# Altium schematic sheet Main.SchDoc
size A3
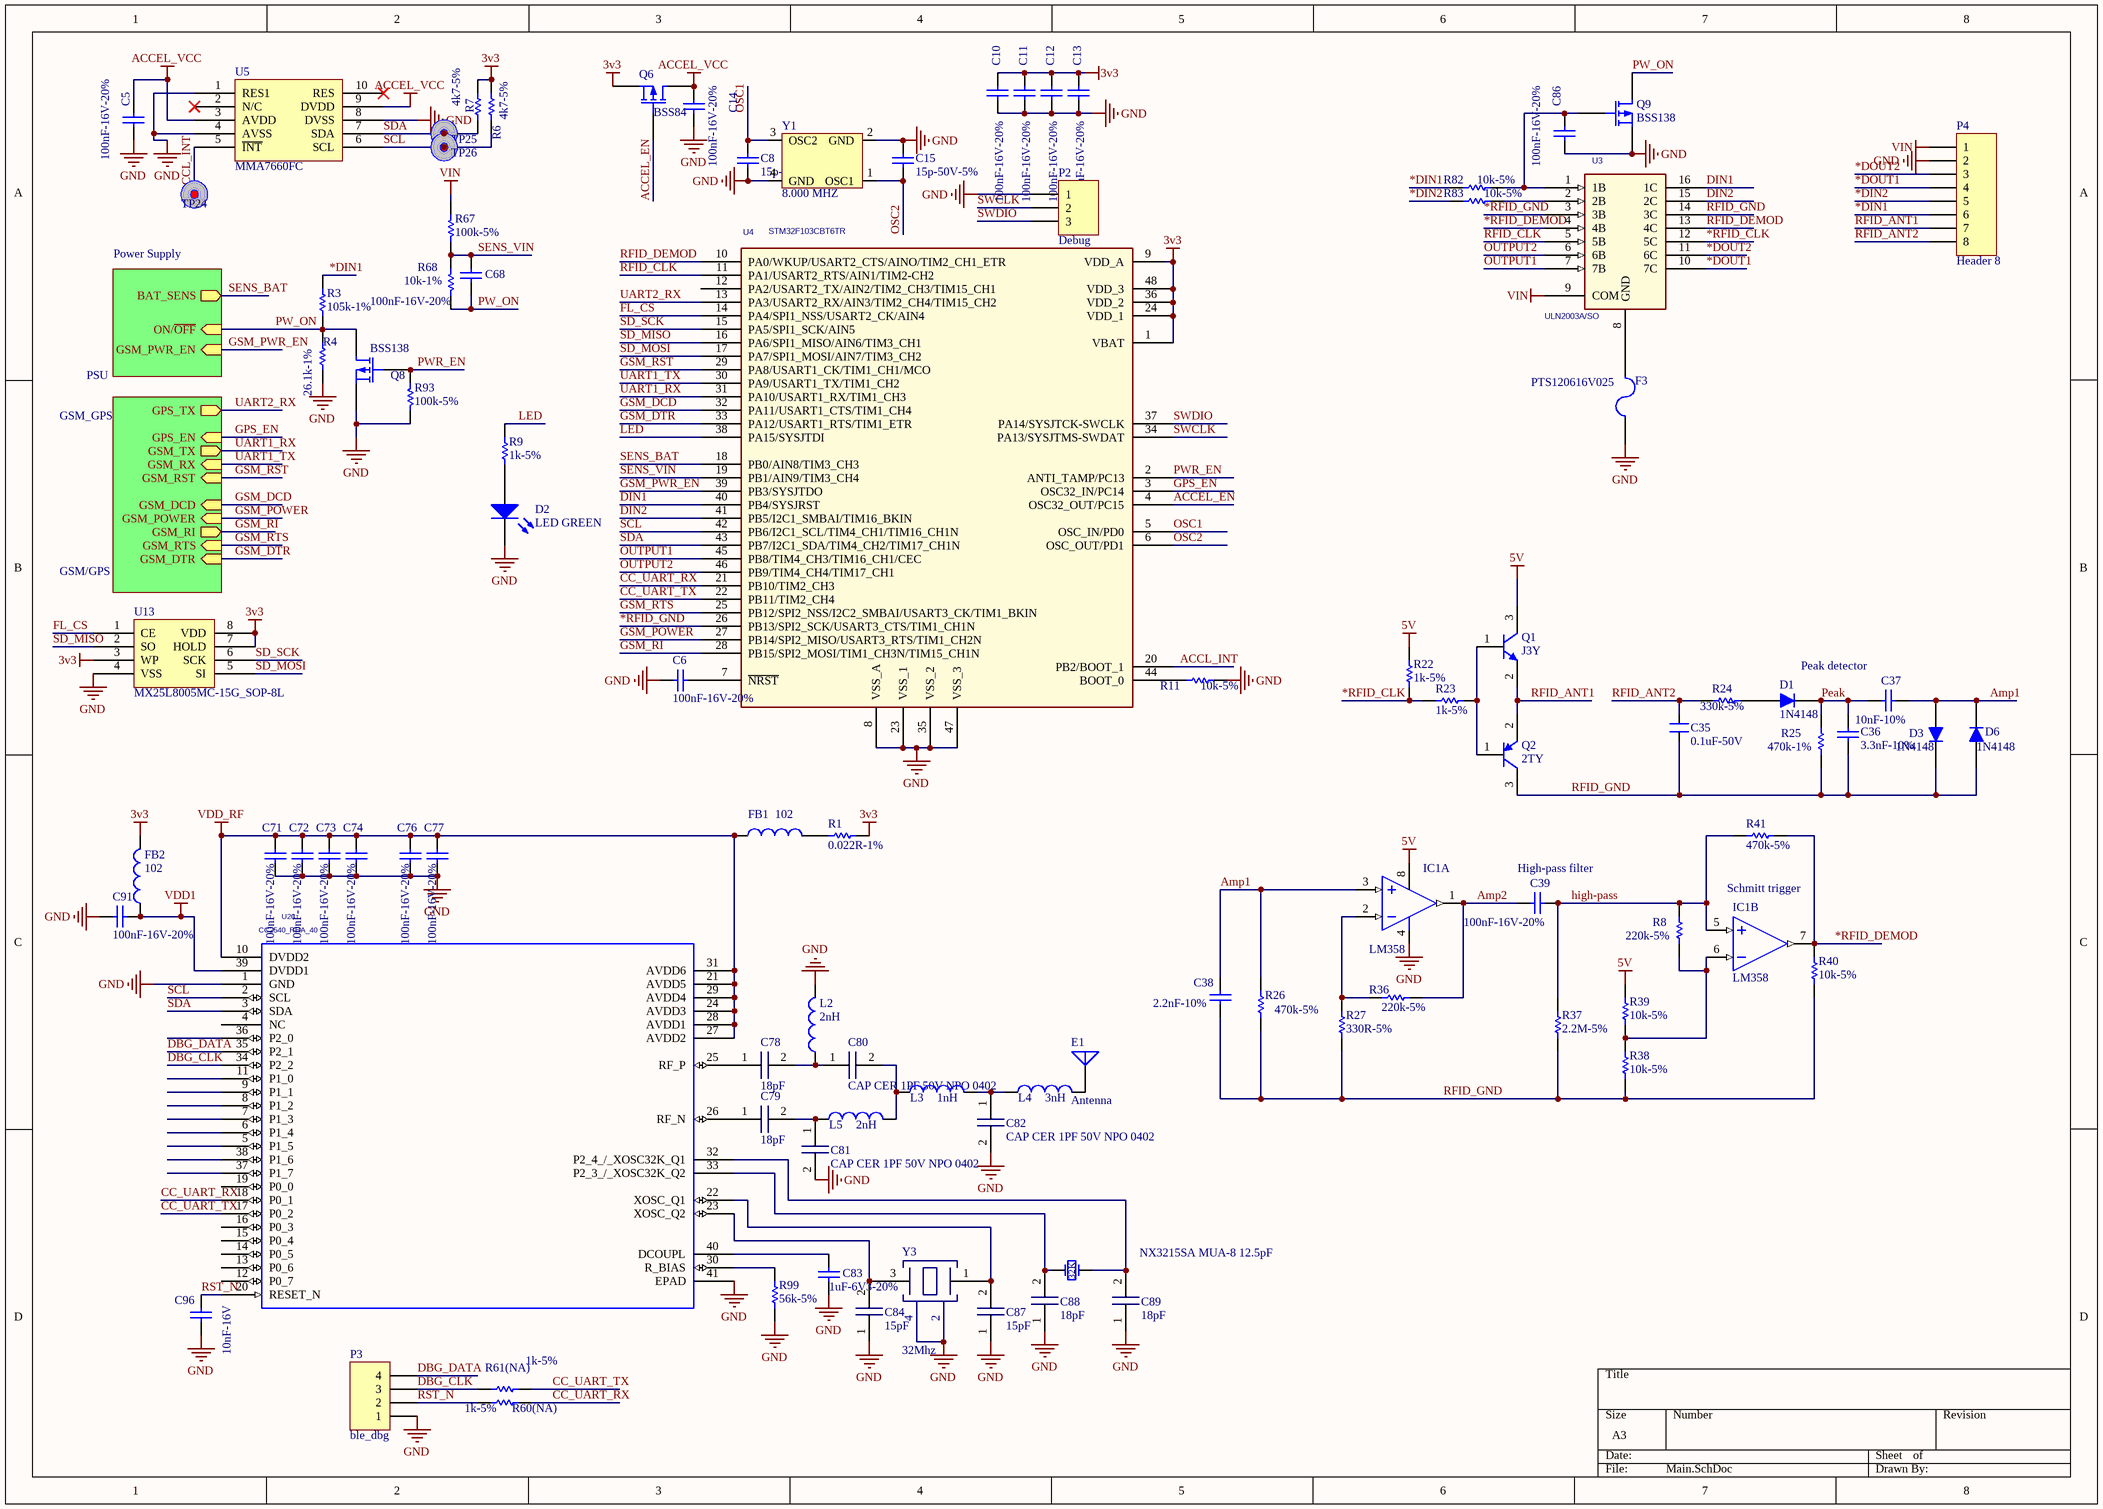
[diagram p0: Main.SchDoc]

## Parts
C5  100nF-16V-20%  [C0402]
C6  100nF-16V-20%  [C0402]
C8  15p-50V-5%  [C0402]
C10  100nF-16V-20%  [C0402]
C11  100nF-16V-20%  [C0402]
C12  100nF-16V-20%  [C0402]
C13  100nF-16V-20%  [C0402]
C14  100nF-16V-20%  [C0402]
C15  15p-50V-5%  [C0402]
C35  0.1uF-50V  [C0603]
C36  3.3nF-10%  [C0402]
C37  10nF-10%  [C0402]
C38  2.2nF-10%  [C0402]
C39  100nF-16V-20%  [C0402]
C68  100nF-16V-20%  [C0402]
C71  100nF-16V-20%  [C0402]
C72  100nF-16V-20%  [C0402]
C73  100nF-16V-20%  [C0402]
C74  100nF-16V-20%  [C0402]
C76  100nF-16V-20%  [C0402]
C77  100nF-16V-20%  [C0402]
C78  18pF  [C0402]
C79  18pF  [C0402]
C80  CAP CER 1PF 50V NPO 0402  [C0402]
C81  CAP CER 1PF 50V NPO 0402  [C0402]
C82  CAP CER 1PF 50V NPO 0402  [C0402]
C83  1uF-6V3-20%  [C0402]
C84  15pF  [C0402]
C86  100nF-16V-20%  [C0402]
C87  15pF  [C0402]
C88  18pF  [C0402]
C89  18pF  [C0402]
C91  100nF-16V-20%  [C0402]
C96  10nF-16V  [C0402]
D1  1N4148  [DO-213AA]
D2  LED GREEN  [LED0603-G]
D3  1N4148  [DO-213AA]
D6  1N4148  [DO-213AA]
E1  Antenna  [A10192-ANTENOVA]
F3  PTS120616V025  [PTC1206]
FB1  102  [R0402]
FB2  102  [R0402]
IC1  LM358  [soic8]  (parts A,B of 2)
L2  2nH  [R0402]
L3  1nH  [R0402]
L4  3nH  [R0402]
L5  2nH  [R0402]
P2  Debug  [HEADER_1.27mm_3PIN]
P3  ble_dbg  [HEADER_1.27mm_4PIN]
P4  Header 8  [HDR1X8]
Q1  J3Y  [SOT23_123]
Q2  2TY  [SOT23_123]
Q6  BSS84  [SOT23-3]
Q8  BSS138  [SOT23-3]
Q9  BSS138  [SOT23-3]
R1  0.022R-1%  [R0402]
R3  105k-1%  [R0402]
R4  26.1k-1%  [R0402]
R6  4k7-5%  [R0402]
R7  4k7-5%  [R0402]
R8  220k-5%  [R0402]
R9  1k-5%  [R0402]
R11  10k-5%  [R0402]
R22  1k-5%  [R0402]
R23  1k-5%  [R0402]
R24  330k-5%  [R0402]
R25  470k-1%  [R0402]
R26  470k-5%  [R0402]
R27  330R-5%  [R0402]
R36  220k-5%  [R0402]
R37  2.2M-5%  [R0402]
R38  10k-5%  [R0402]
R39  10k-5%  [R0402]
R40  10k-5%  [R0402]
R41  470k-5%  [R0402]
R60(NA)  1k-5%  [R0402]
R61(NA)  1k-5%  [R0402]
R67  100k-5%  [R0402]
R68  10k-1%  [R0402]
R82  10k-5%  [R0402]
R83  10k-5%  [R0402]
R93  100k-5%  [R0402]
R99  56k-5%  [R0402]
TP24  TP  [test_point]  (value not drawn)
TP25  TP  [test_point]  (value not drawn)
TP26  TP  [test_point]  (value not drawn)
U3  ULN2003A/SO  [SO16-150mil]
U4  STM32F103CBT6TR  [TQFP-48-P0.5]
U5  MMA7660FC  [MMA7660FC]
U13  MX25L8005MC-15G_SOP-8L  [SO8-200mil]
U20  CC2540_RHA_40  [CC254x]
Y1  8.000 MHZ  [SMD CRYSTAL 4 x 2.5]
Y3  32Mhz  [SMD CRYSTAL 2.5 x 2]
Y4  NX3215SA MUA-8 12.5pF  [Crystal-3.2x1.5]

## Sub-sheets
GSM/GPS = GSM_GPS: GSM_POWER (in), GSM_RX (in), GSM_TX (out), GPS_TX (out), GSM_DCD (in), GSM_RI (out), GPS_EN (in), GSM_RST (in), GSM_RTS (in), GSM_DTR (in)
Power Supply = PSU: ON/~{OFF} (in), GSM_PWR_EN (in), BAT_SENS (out)

## Nets
3v3: C10.1 C11.1 C12.1 C13.1 FB2.2 Q6.2(S) R1.2 R6.2 R7.2 U4.1(VBAT) U4.9(VDD_A) U4.24(VDD_1) U4.36(VDD_2) U4.48(VDD_3) U13.3(WP) U13.7(HOLD) U13.8(VDD)
5V: IC1.8(+V) Q1.3(C) R22.2 R39.1
ACCEL_VCC: C5.2 C14.2 Q6.3(D) U5.3(AVDD) U5.9(DVDD)
GND: C5.1 C6.2 C8.1 C10.2 C11.2 C12.2 C13.2 C14.1 C15.2 C71.2 C72.2 C73.2 C74.2 C76.2 C77.2 C81.2 C82.2 C83.2 C84.1 C86.1 C87.1 C88.1 C89.1 C91.1 C96.1 D2.2(K) F3.2 IC1.4(-V) L2.2 P2.1 P3.1 P4.2 Q8.2(S) Q9.2(S) R4.1 R11.1 R93.2 R99.1 U4.8(VSS_A) U4.23(VSS_1) U4.35(VSS_2) U4.47(VSS_3) U5.1(RES1) U5.4(AVSS) U5.8(DVSS) U13.4(VSS) U20.1(GND) U20.41(EPAD) Y1.2(GND) Y1.4(GND) Y3.2 Y3.4
VDD1: C91.2 FB2.1 U20.39(DVDD1)
VDD_RF: C71.1 C72.1 C73.1 C74.1 C76.1 C77.1 FB1.1 U20.10(DVDD2) U20.21(AVDD5) U20.24(AVDD3) U20.27(AVDD2) U20.28(AVDD1) U20.29(AVDD4) U20.31(AVDD6)
VIN: P4.1 R67.1 U3.9(COM)
*DIN1: P4.6 R3.2 R82.1
*DIN2: P4.5 R83.2
*DOUT1: P4.4 U3.10(7C)
*DOUT2: P4.3 U3.11(6C)
*RFID_CLK: R22.1 R23.2 U3.12(5C)
*RFID_DEMOD: IC1.7(OUT) R40.2 R41.1 U3.4(4B)
*RFID_GND: U3.3(3B) U4.26(PB13/SPI2_SCK/USART3_CTS/TIM1_CH1N)
ACCEL_EN: Q6.1(G) U4.4(OSC32_OUT/PC15)
ACCL_INT: TP24.1(TP) U4.20(PB2/BOOT_1) U5.5(~{INT})
Amp1: C37.2 C38.2 D3.1(A) D6.2(K) IC1.3(IN+) R26.1
Amp2: C39.2 IC1.1(OUT) R36.1
CC_UART_RX: R60(NA).1 U4.21(PB10/TIM2_CH3) U20.18(P0_1)
CC_UART_TX: R61(NA).1 U4.22(PB11/TIM2_CH4) U20.17(P0_2)
DBG_CLK: P3.3 R61(NA).2 U20.34(P2_2)
DBG_DATA: P3.4 U20.35(P2_1)
DIN1: U3.16(1C) U4.40(PB4/SYSJRST)
DIN2: U3.15(2C) U4.41(PB5/I2C1_SMBAI/TIM16_BKIN)
FL_CS: U4.14(PA4/SPI1_NSS/USART2_CK/AIN4) U13.1(CE)
GPS_EN: U4.3(OSC32_IN/PC14) ; sheet GSM/GPS/GPS_EN
GSM_DCD: U4.32(PA11/USART1_CTS/TIM1_CH4) ; sheet GSM/GPS/GSM_DCD
GSM_DTR: U4.33(PA12/USART1_RTS/TIM1_ETR) ; sheet GSM/GPS/GSM_DTR
GSM_POWER: U4.27(PB14/SPI2_MISO/USART3_RTS/TIM1_CH2N) ; sheet GSM/GPS/GSM_POWER
GSM_PWR_EN: U4.39(PB3/SYSJTDO) ; sheet Power Supply/GSM_PWR_EN
GSM_RI: U4.28(PB15/SPI2_MOSI/TIM1_CH3N/TIM15_CH1N) ; sheet GSM/GPS/GSM_RI
GSM_RST: U4.29(PA8/USART1_CK/TIM1_CH1/MCO) ; sheet GSM/GPS/GSM_RST
GSM_RTS: U4.25(PB12/SPI2_NSS/I2C2_SMBAI/USART3_CK/TIM1_BKIN) ; sheet GSM/GPS/GSM_RTS
high-pass: C39.1 IC1.5(IN+) R8.2 R37.2 R41.2
LED: R9.2 U4.38(PA15/SYSJTDI)
OSC1: C8.2 U4.5(OSC_IN/PD0) Y1.3(OSC2)
OSC2: C15.1 U4.6(OSC_OUT/PD1) Y1.1(OSC1)
OUTPUT1: U3.7(7B) U4.45(PB8/TIM4_CH3/TIM16_CH1/CEC)
OUTPUT2: U3.6(6B) U4.46(PB9/TIM4_CH4/TIM17_CH1)
Peak: C36.1 C37.1 D1.2(K) R25.1
PW_ON: C68.1 Q8.3(D) Q9.3(D) R3.1 R4.2 R68.1 ; sheet Power Supply/ON/~{OFF}
PWR_EN: Q8.1(G) R93.1 U4.2(ANTI_TAMP/PC13)
RFID_ANT1: P4.7 Q1.2(E) Q2.2(E)
RFID_ANT2: C35.2 P4.8 R24.2
RFID_CLK: U3.5(5B) U4.11(PA1/USART2_RTS/AIN1/TIM2-CH2)
RFID_DEMOD: U3.13(4C) U4.10(PA0/WKUP/USART2_CTS/AINO/TIM2_CH1_ETR)
RFID_GND: C35.1 C36.2 C38.1 D3.2(K) D6.1(A) Q2.3(C) R25.2 R26.2 R27.1 R37.1 R38.2 R40.1 U3.14(3C)
RST_N: C96.2 P3.2 R60(NA).2 U20.20(RESET_N)
SCL: R6.1 TP26.1(TP) U4.42(PB6/I2C1_SCL/TIM4_CH1/TIM16_CH1N) U5.6(SCL) U20.2(SCL)
SD_MISO: U4.16(PA6/SPI1_MISO/AIN6/TIM3_CH1) U13.2(SO)
SD_MOSI: U4.17(PA7/SPI1_MOSI/AIN7/TIM3_CH2) U13.5(SI)
SD_SCK: U4.15(PA5/SPI1_SCK/AIN5) U13.6(SCK)
SDA: R7.1 TP25.1(TP) U4.43(PB7/I2C1_SDA/TIM4_CH2/TIM17_CH1N) U5.7(SDA) U20.3(SDA)
SENS_BAT: U4.18(PB0/AIN8/TIM3_CH3) ; sheet Power Supply/BAT_SENS
SENS_VIN: C68.2 R67.2 R68.2 U4.19(PB1/AIN9/TIM3_CH4)
SWCLK: P2.2 U4.34(PA13/SYSJTMS-SWDAT)
SWDIO: P2.3 U4.37(PA14/SYSJTCK-SWCLK)
UART1_RX: U4.31(PA10/USART1_RX/TIM1_CH3) ; sheet GSM/GPS/GSM_TX
UART1_TX: U4.30(PA9/USART1_TX/TIM1_CH2) ; sheet GSM/GPS/GSM_RX
UART2_RX: U4.13(PA3/USART2_RX/AIN3/TIM2_CH4/TIM15_CH2) ; sheet GSM/GPS/GPS_TX
NetC6_1: C6.1 U4.7(~{NRST})
NetC78_1: C78.1 U20.25(RF_P)
NetC78_2: C78.2 C80.1 L2.1
NetC79_1: C79.1 U20.26(RF_N)
NetC79_2: C79.2 C81.1 L5.1
NetC80_2: C80.2 L3.1 L5.2
NetC82_1: C82.1 L3.2 L4.1
NetC83_1: C83.1 U20.40(DCOUPL)
NetC84_2: C84.2 U20.23(XOSC_Q2) Y3.3
NetC86_2: C86.2 Q9.1(G) R82.2 U3.1(1B)
NetC87_2: C87.2 U20.22(XOSC_Q1) Y3.1
NetC88_2: C88.2 U20.33(P2_3_/_XOSC32K_Q2) Y4.1(OSC1)
NetC89_2: C89.2 U20.32(P2_4_/_XOSC32K_Q1) Y4.2(OSC2)
NetD1_1: D1.1(A) R24.1
NetD2_1: D2.1(A) R9.1
NetE1_1: E1.1(A) L4.2
NetF3_1: F3.1 U3.8(GND)
NetFB1_2: FB1.2 R1.1
NetIC1_2: IC1.2(IN-) R27.2 R36.2
NetIC1_6: IC1.6(IN-) R8.1 R38.1 R39.2
NetQ1_1: Q1.1(B) Q2.1(B) R23.1
NetR11_2: R11.2 U4.44(BOOT_0)
NetR83_1: R83.1 U3.2(2B)
NetR99_2: R99.2 U20.30(R_BIAS)

Not connected (* = marked no-connect by the designer): U4 12(PA2/USART2_TX/AIN2/TIM2_CH3/TIM15_CH1); U5 2(N/C)* 10(RES)*; U20 4(NC) 5(P1_5) 6(P1_4) 7(P1_3) 8(P1_2) 9(P1_1) 11(P1_0) 12(P0_7) 13(P0_6) 14(P0_5) 15(P0_4) 16(P0_3) 19(P0_0) 36(P2_0) 37(P1_7) 38(P1_6)

## Notes on the sheet
- Peak detector
- (near C39) High-pass filter
- Schmitt trigger
- (in symbol XTAL/32KHz) 32K

## Library data of the parts
C5 C6 C10-C14 C39 C68 C71-C74 C76 C77 C86 C91 = Cap: CAP CER 0.1UF 16V Y5V 0402; Manufacturer: Yageo; Manufacturer Part Number: CC0402ZRY5V7BB104; Published: 8-Jun-2000; LatestRevisionDate: 17-Jul-2002; LatestRevisionNote: Re-released for DXP Platform.; PackageReference: C0402; Publisher: Altium Limited; Value: 100nF-16V-20%; Digi-Key Part Number: 311-1047-1-ND; Unit Price: 0.00250
C8 C15 = Cap: CAP CER 15PF 50V 5% NPO 0402; Manufacturer: Yageo; Manufacturer Part Number: CC0402JRNPO9BN150; Published: 8-Jun-2000; LatestRevisionDate: 17-Jul-2002; LatestRevisionNote: Re-released for DXP Platform.; PackageReference: C0402; Publisher: Altium Limited; Value: 15p-50V-5%; Digi-Key Part Number: 311-1017-1-ND; Unit Price: 0.00270
C35 = CN2: CAP CER 0.1UF 50V Y5V 0603; Manufacturer: Yageo; Manufacturer Part Number: CC0603ZRY5V9BB104; Digi-Key Part Number: 311-1343-2-ND; Unit Price: 0.00327; Value: 0.1uF-50V
C36 = 1nF-50V-C0805: CAP CER 3300PF 50V 10% X7R 0402; Manufacturer: Yageo; Manufacturer Part Number: CC0402KRX7R9BB332; Value: 3.3nF-10%; Digi-Key Part Number: 311-1034-2-ND; Unit Price: 0.00305
C37 = 10nF-50V-C0805: Non-Polarized Capacitor; Manufacturer: Yageo; Manufacturer Part Number: 311-1349-2-ND; Value: 10nF-10%; Digi-Key Part Number: CC0402KRX7R9BB103; Unit Price: 0.00221
C38 = 2.2nF-50V-C0805: CAP CER 2200PF 50V 10% X7R 0402; Manufacturer: Yageo; Manufacturer Part Number: CC0402KRX7R9BB222; Value: 2.2nF-10%; Digi-Key Part Number: 311-1037-2-ND; Unit Price: 0.00281
C78 C79 C88 C89 = 18pF: Manufacturer: Yageo; Manufacturer Part Number: CC0402JRNPO9BN220; Description: CAP CER 22PF 50V 5% NPO 0402; Digi-Key Part Number: 311-1018-1-ND
C80-C82 = 1pF: Manufacturer: Yageo; Manufacturer Part Number: CC0402CRNPO9BN1R0; Digi-Key Part Number: CC0402CRNPO9BN1R0-ND; Description: CAP CER 1PF 50V NPO 0402
C83 = Cap: CAP CER 1UF 6.3V Y5V 0402; Manufacturer: Yageo; Manufacturer Part Number: CC0402ZRY5V5BB105; Published: 8-Jun-2000; LatestRevisionDate: 17-Jul-2002; LatestRevisionNote: Re-released for DXP Platform.; PackageReference: C0402; Publisher: Altium Limited; Value: 1uF-6V3-20%; Digi-Key Part Number: 311-1377-2-ND; Unit Price: 0.00465
C84 C87 = 15pF: Manufacturer: Yageo; Manufacturer Part Number: CC0402JRNPO9BN220; Description: CAP CER 22PF 50V 5% NPO 0402; Digi-Key Part Number: 311-1018-1-ND
C96 = 10nF-16V-C0402-10%: CAP CER 10000PF 16V 10% X7R 0402; Manufacturer: Yageo; Manufacturer Part Number: CC0402KRX7R7BB103; Digi-Key Part Number: 311-1042-2-ND; Unit Price: 0.00216
D1 D3 D6 = 1N4148: DIODE SMALL SIG 100V 0.2A ALF2; Manufacturer: NXP Semiconductors; Manufacturer Part Number: 1N4148,113; Digi-Key Part Number: 568-1360-1-ND; Unit Price: 0.08100
D2 = LED2: LED GREEN CLEAR THIN 0603 SMD; Manufacturer: Lite-On Inc; Manufacturer Part Number: LTST-C191KGKT; Published: 8-Jun-2000; LatestRevisionDate: 17-Jul-2002; LatestRevisionNote: Re-released for DXP Platform.; PackageVersion: Feb-2002; PackageReference: 3.2X1.6X1.1; Publisher: Altium Limited; Digi-Key Part Number: 160-1446-2-ND; Unit Price: 0.03780; Value: LED GREEN
E1 = Antenna: Generic Antenna; Published: 24-Mar-1999; LatestRevisionDate: 17-Jul-2002; LatestRevisionNote: Re-released for DXP Platform.; PackageReference: PIN1; Publisher: Altium Limited
F3 = Fuse 2: PTC RESETTABLE SMD 1206 16V .25A; Manufacturer: Cooper Bussmann; Published: 8-Jun-2000; LatestRevisionDate: 17-Jul-2002; LatestRevisionNote: Re-released for DXP Platform.; PackageReference: PIN-W2/E2.8; Publisher: Altium Limited; Digi-Key Part Number: 283-3137-2-ND; Manufacturer Part Number: 120616V025; Unit Price: 0.12375; Value: PTS120616V025; tme part: SMD1815P050TF
FB1 FB2 L2-L5 = Inductor: Manufacturer Part Number: LQW18AN27NJ00D; Manufacturer: Murata Electronics North America; Code_IEC: 1005; Published: 8-Jun-2000; LatestRevisionDate: 29-May-2009; LatestRevisionNote: IPC-7351 Footprint Added.; PackageReference: 0402-A; Publisher: Altium Limited; PackageDescription: Chip Inductor; Code_JEITA: 0402; Digi-Key Part Number: 490-1174-1-ND
  FB1 FB2: Value: 102
  L2 L5: Value: 2nH
  L3: Value: 1nH
  L4: Value: 3nH
IC1 = LM358: Low-Power Dual Operational Amplifier; Value: LM358
P2 = Header 3: NA; LatestRevisionDate: 17-Jul-2002; LatestRevisionNote: Re-released for DXP Platform.; Publisher: Altium Limited
P3 = Header 4: Header, 4-Pin; LatestRevisionDate: 17-Jul-2002; LatestRevisionNote: Re-released for DXP Platform.; Publisher: Altium Limited
P4 = Header 8: Header, 8-Pin; LatestRevisionDate: 17-Jul-2002; LatestRevisionNote: Re-released for DXP Platform.; Publisher: Altium Limited
Q1 = NPN_123: NPN Bipolar Transistor
Q2 = PNP_123: PNP Bipolar Transistor
Q6 = MOSFET-P: MOSFET P-CH 50V 130MA SOT23-3; Manufacturer: Diodes Inc; Manufacturer Part Number: BSS84-7-F; Published: 8-Jun-2000; LatestRevisionDate: 17-Jul-2002; LatestRevisionNote: Re-released for DXP Platform.; PackageVersion: 1995/1996; PackageReference: E3; Publisher: Altium Limited; Digi-Key Part Number: BSS84-FDITR-ND; Unit Price: 0.06000
Q8 Q9 = MOSFET-P: MOSFET N-CH 50V 200MA SOT23-3; Manufacturer: Diodes Inc; Manufacturer Part Number: BSS138-7-F; Published: 8-Jun-2000; LatestRevisionDate: 17-Jul-2002; LatestRevisionNote: Re-released for DXP Platform.; PackageVersion: 1995/1996; PackageReference: E3; Publisher: Altium Limited; Digi-Key Part Number: BSS138-FDICT-ND; Unit Price: 0.06575
R1 = 0.022R-1%-R0805: RES 0.022 OHM 1/4W 1% 0805 SMD; Manufacturer: Yageo; Manufacturer Part Number: PF0805FRF7W0R022L; Digi-Key Part Number: 311-0.022NSTR-ND; Unit Price: 0.15700
R3 = 105k-1%-R0805: RES 105k OHM 1/4W 1% 0805 SMD; Manufacturer: Yageo; Manufacturer Part Number: RC0805FR-07105KL; Digi-Key Part Number: 311-105KCRTR-ND; Unit Price: 0.00241
R4 = 26.1k-1%-R0805: RES 26.1k OHM 1/4W 1% 0805 SMD; Manufacturer: Yageo; Manufacturer Part Number: RC0805FR-0726K1L; Digi-Key Part Number: 311-26.1KCRTR-ND; Unit Price: 0.00241
R6 R7 = Res1: RES 4.7K OHM 1/16W 5% 0402 SMD; Manufacturer: Yageo; Manufacturer Part Number: RC0402JR-074K7L; Description: RES 10K OHM 1/10W 5% 0603 SMD; Published: 8-Jun-2000; LatestRevisionDate: 17-Jul-2002; LatestRevisionNote: Re-released for DXP Platform.; PackageReference: R0603; Publisher: Altium Limited; Value: 4k7-5%; Digi-Key Part Number: 311-4.7KJRCT-ND; Unit Price: 0.00178
R8 R36 = 220k-5%-R0805: RES 220k OHM 1/8W 5% 0805 SMD; Manufacturer: Yageo; Manufacturer Part Number: RC0805JR-07220KL; Digi-Key Part Number: 311-220KARTR-ND; Unit Price: 0.00209
R9 R60(NA) R61(NA) = Res1: RES 1.0K OHM 1/16W 5% 0402 SMD; Manufacturer: Yageo; Manufacturer Part Number: RC0402JR-071KL; Published: 8-Jun-2000; LatestRevisionDate: 17-Jul-2002; LatestRevisionNote: Re-released for DXP Platform.; PackageReference: R0603; Publisher: Altium Limited; Value: 1k-5%; Digi-Key Part Number: 311-1.0KJRCT-ND; Unit Price: 0.00178
R11 R82 R83 = Res1: RES 10K OHM 1/16W 5% 0402 SMD; Manufacturer: Yageo; Manufacturer Part Number: RC0402JR-0710KL; Description: RES 10K OHM 1/10W 5% 0603 SMD; Published: 8-Jun-2000; LatestRevisionDate: 17-Jul-2002; LatestRevisionNote: Re-released for DXP Platform.; PackageReference: R0603; Publisher: Altium Limited; Value: 10k-5%; Digi-Key Part Number: 311-10KJRCT-ND; Unit Price: 0.00178
R22 R23 = 1k-5%-R0805: RES 1k OHM 1/8W 5% 0805 SMD; Manufacturer: Yageo; Manufacturer Part Number: RC0805JR-071KL; Digi-Key Part Number: 311-1.0KARTR-ND; Unit Price: 0.00209
R24 = 330k-5%-R0805: RES 330k OHM 1/8W 5% 0805 SMD; Manufacturer: Yageo; Manufacturer Part Number: RC0805JR-07330KL; Digi-Key Part Number: 311-330KARTR-ND; Unit Price: 0.00209
R25 = 470k-1%-R0805: RES 470k OHM 1/4W 1% 0805 SMD; Manufacturer: Yageo; Manufacturer Part Number: RC0805FR-07470KL; Digi-Key Part Number: 311-470KCRTR-ND; Unit Price: 0.00241
R26 R41 = 470k-5%-R0805: RES 470k OHM 1/8W 5% 0805 SMD; Manufacturer: Yageo; Manufacturer Part Number: RC0805JR-07470KL; Digi-Key Part Number: 311-470KARTR-ND; Unit Price: 0.00209
R27 = 330R-5%-R0805: RES 330 OHM 1/8W 5% 0805 SMD; Manufacturer: Yageo; Manufacturer Part Number: RC0805JR-07330RL; Digi-Key Part Number: 311-330ARTR-ND; Unit Price: 0.00209
R37 = 2.2M-5%-R0805: RES 2.2M OHM 1/8W 5% 0805 SMD; Manufacturer: Yageo; Manufacturer Part Number: RC0805JR-072M2L; Digi-Key Part Number: 311-2.2MARTR-ND; Unit Price: 0.00209
R38-R40 = 10k-5%-R0805: RES 10k OHM 1/8W 5% 0805 SMD; Manufacturer: Yageo; Manufacturer Part Number: RC0805JR-0710KL; Digi-Key Part Number: 311-10KARTR-ND; Unit Price: 0.00209
R67 R93 = Res1: RES 100K OHM 1/16W 5% 0402 SMD; Manufacturer: Yageo; Manufacturer Part Number: RC0402JR-07100KL; Published: 8-Jun-2000; LatestRevisionDate: 17-Jul-2002; LatestRevisionNote: Re-released for DXP Platform.; PackageReference: R0402; Publisher: Altium Limited; Value: 100k-5%; Digi-Key Part Number: 311-100KJRCT-ND; Unit Price: 0.00171
R68 = Res1: RES 10.0K OHM 1/16W 1% 0402 SMD; Manufacturer: Yageo; Manufacturer Part Number: RC0402FR-0710KL; Description: RES 10K OHM 1/10W 5% 0603 SMD; Published: 8-Jun-2000; LatestRevisionDate: 17-Jul-2002; LatestRevisionNote: Re-released for DXP Platform.; PackageReference: R0603; Publisher: Altium Limited; Value: 10k-1%; Digi-Key Part Number: 311-10.0KLRTR-ND; Unit Price: 0.00149
R99 = 56k-5%-R0805: RES 56k OHM 1/8W 5% 0805 SMD; Manufacturer: Yageo; Manufacturer Part Number: RC0805JR-0756KL; Digi-Key Part Number: 311-56KARTR-ND; Unit Price: 0.00209
U3 = ULN2003A/SO_0: IC DARL TRANS ARRAY 16-SOIC; Manufacturer Part Number: ULN2003ADR; Manufacturer: Texas Instruments; Digi-Key Part Number: 296-1368-2-ND; Unit Price: 0.144
U4 = ATmega128_4: MCU ARM 128K FLASH/TIMER; Manufacturer: STMicroelectronics; Digi-Key Part Number: 497-6288-ND; Manufacturer Part Number: STM32F103CBT6TR; Unit Price: 2
U5 = MMA7660FC: ACCELEROMETER 3X3 DGTL 10-DFN; Manufacturer: Freescale Semiconductor; Manufacturer Part Number: MMA7660FCT; Unit Price: 0.67000; Digi-Key Part Number: MMA7660FCT-ND
U13 = FlashIC: Manufacturer: Tyrone
U20 = CC2540_RHA_40: 2.4GHz Bluetooth Low Energy System-on-Chip Solution; Manufacturer: Texas Instruments; GENERIC_PART_NUMBER: CC2540; INDUSTRY_STD_PKG_TYPE: VQFN; FAMILY_NAME: Bluetooth Low Energy Technology; PIN_COUNT: 40; PACKAGE_DESIGNATOR: RHA; Value: CC2540_RHA_40; Datasheet URL: http://www.ti.com/lit/gpn/CC2540
Y1 = CRYSTAL-SMT: CRYSTAL 8.000 MHZ 18PF SMD; Manufacturer: TXC CORPORATION; Manufacturer Part Number: 7B-8.000MAAJ-T; Digi-Key Part Number: 887-1452-2-ND; Unit Price: 0.39000; Value: 8.000 MHZ
Y3 = XTAL
Y4 = XTAL/32KHz: Crystal Oscillator; Published: 8-Jun-2000; LatestRevisionDate: 17-Jul-2002; LatestRevisionNote: Re-released for DXP Platform.; PackageReference: R38; Publisher: Altium Limited